# EAGLE design utrak (EAGLE 6.4)
uTrak Balloon Tracker Version 1.0
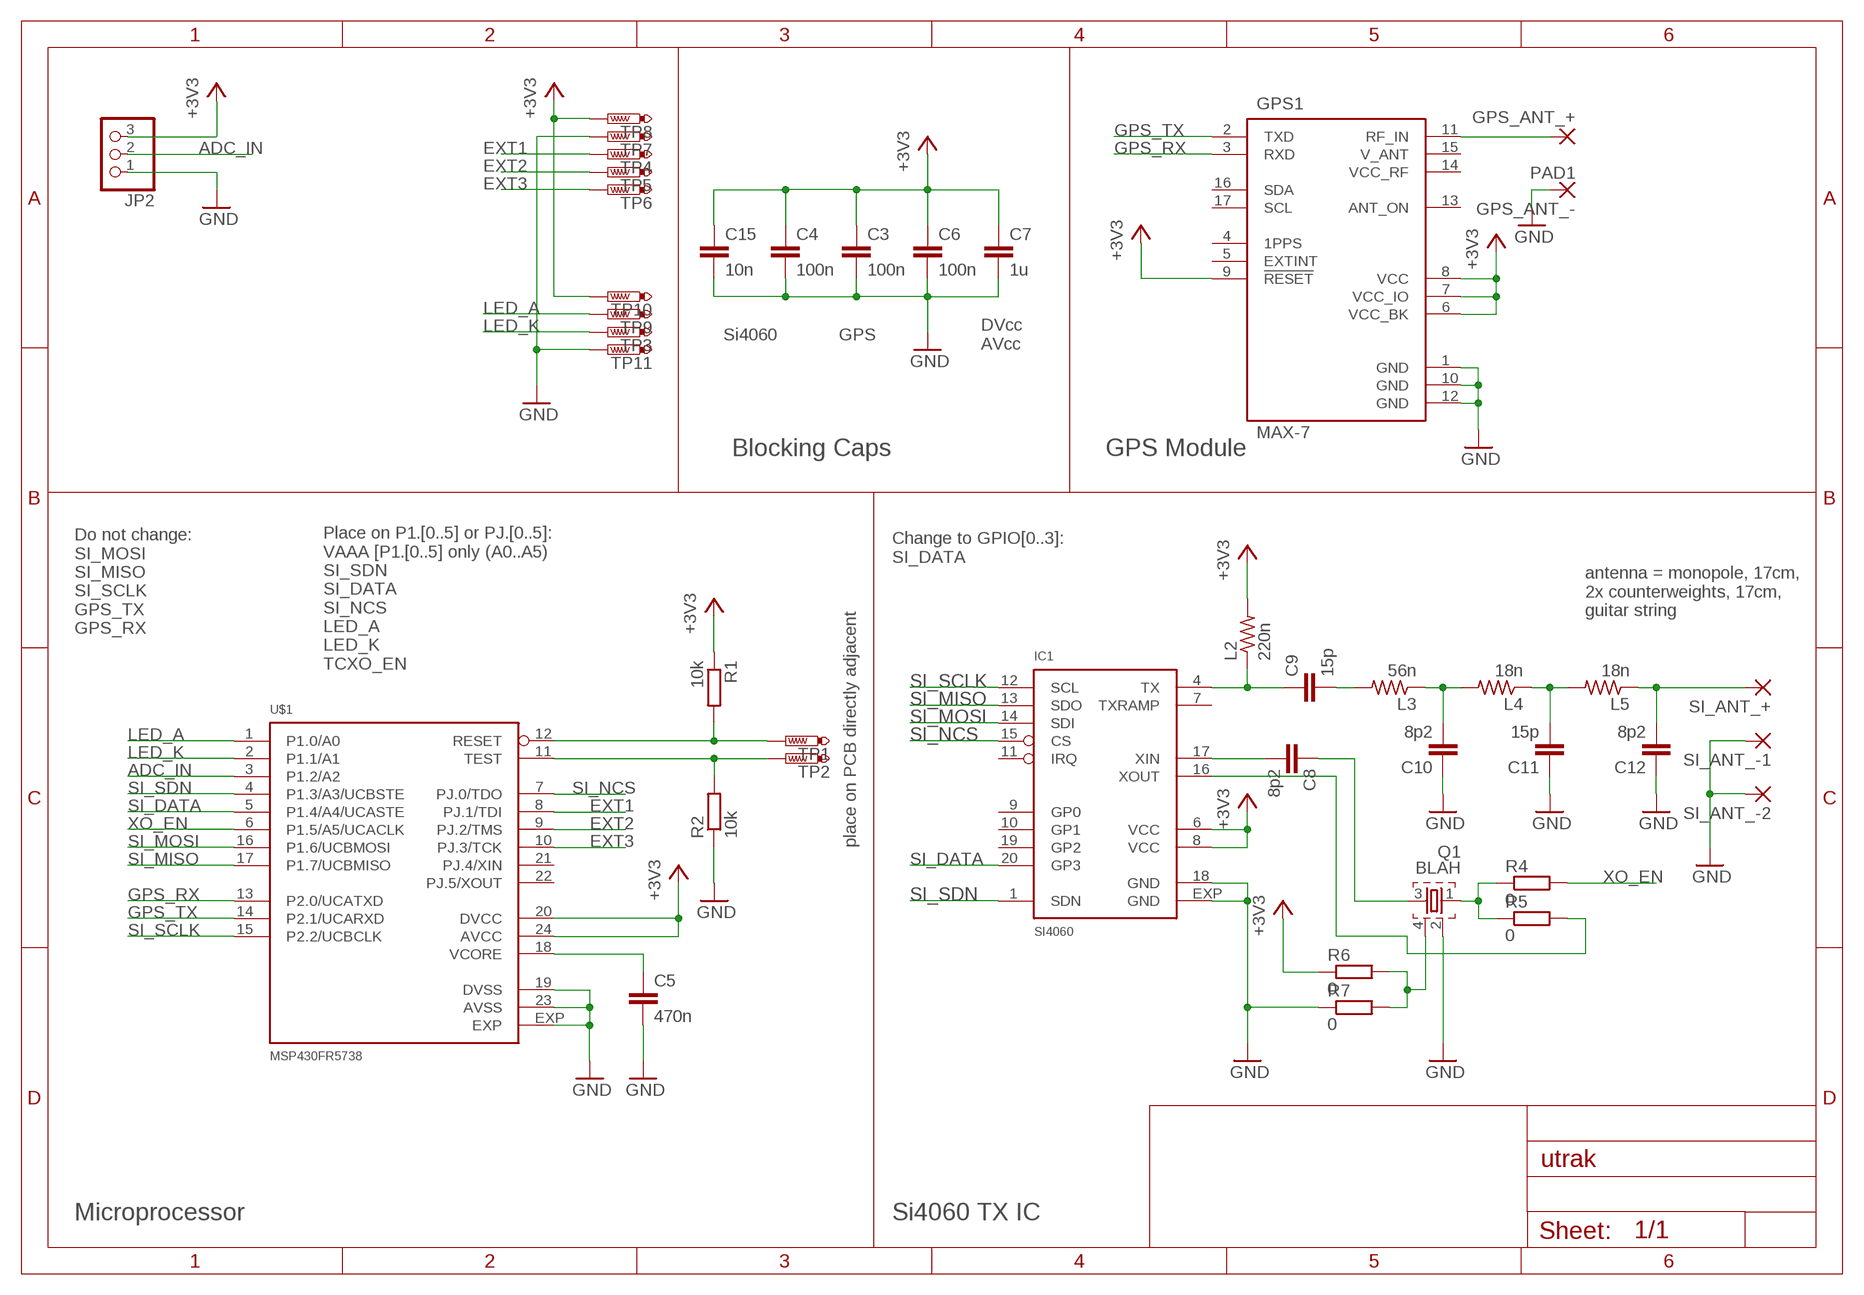
[diagram p0: schematic, sheet 1]

## Parts
C3  100n  C-EUC0603  [C0603]
C4  100n  C-EUC0603  [C0603]
C5  470n  C-EUC0805  [C0805]
C6  100n  C-EUC0603  [C0603]
C7  1u  C-EUC0603  [C0603]
C8  8p2  C-EUC0402  [C0402]
C9  15p  C-EUC0603  [C0603]
C10  8p2  C-EUC0603  [C0603]
C11  15p  C-EUC0603K  [C0603K]
C12  8p2  C-EUC0603  [C0603]
C15  10n  C-EUC0603  [C0603]
GPS1  MAX-7  [UBLOX-7]
GPS_ANT_+  SMD2  [SMD1,27-2,54]
GPS_ANT_-  PAD1  [SMD1,27-2,0]
IC1  SI4060  [QFN20]
JP2  PINHD-1X3  [1X03]
L2  220n  R-US_R0603  [R0603]
L3  56n  R-US_R0603  [R0603]
L4  18n  R-US_R0603  [R0603]
L5  18n  R-US_R0603  [R0603]
Q1  BLAH  [CTS406]
R1  10k  R-EU_R0402  [R0402]
R2  10k  R-EU_R0402  [R0402]
R4  0  R-EU_R0402  [R0402]
R5  0  R-EU_R0402  [R0402]
R6  0  R-EU_R0402  [R0402]
R7  0  R-EU_R0402  [R0402]
SI_ANT_+  SMD2  [SMD1,27-2,54]
SI_ANT_-1  SMD2  [SMD1,27-2,54]
SI_ANT_-2  SMD2  [SMD1,27-2,54]
TP1  PTR1TP07R  [TP07R]
TP2  PTR1TP07R  [TP07R]
TP3  PTR1TP07R  [TP07R]
TP4  PTR1TP07R  [TP07R]
TP5  PTR1TP07R  [TP07R]
TP6  PTR1TP07R  [TP07R]
TP7  PTR1TP07R  [TP07R]
TP8  PTR1TP07R  [TP07R]
TP9  PTR1TP07R  [TP07R]
TP10  PTR1TP07R  [TP07R]
TP11  PTR1TP07R  [TP07R]
U$1  MSP430FR5738  [QFN24-4X4]

## Nets
+3V3: C3.1 C4.1 C6.1 C7.1 C15.1 GPS1.6(VCC_BK) GPS1.7(VCC_IO) GPS1.8(VCC) GPS1.9(!RESET) IC1.6(VCC) IC1.8(VCC) JP2.3 L2.2 R1.1 R6.1 TP8.TP TP10.TP U$1.20(DVCC) U$1.24(AVCC)
ADC_IN: JP2.2 U$1.3(P1.2/A2)
EXT1: TP4.TP U$1.8(PJ.1/TDI)
EXT2: TP5.TP U$1.9(PJ.2/TMS)
EXT3: TP6.TP U$1.10(PJ.3/TCK)
GND: C3.2 C4.2 C5.2 C6.2 C7.2 C10.1 C11.1 C12.1 C15.2 GPS1.1(GND) GPS1.10(GND) GPS1.12(GND) GPS_ANT_-.P$1(P) IC1.18(GND) IC1.EXP(GND) JP2.1 Q1.2 R2.1 R7.1 SI_ANT_-1.1(P) SI_ANT_-2.1(P) TP7.TP TP11.TP U$1.19(DVSS) U$1.23(AVSS) U$1.EXP
GPS_ANT_+: GPS1.11(RF_IN) GPS_ANT_+.1(P)
GPS_RX: GPS1.3(RXD) U$1.13(P2.0/UCATXD)
GPS_TX: GPS1.2(TXD) U$1.14(P2.1/UCARXD)
LED_A: TP9.TP U$1.1(P1.0/A0)
LED_K: TP3.TP U$1.2(P1.1/A1)
N$2: C5.1 U$1.18(VCORE)
N$3: R2.2 TP2.TP U$1.11(TEST)
N$4: R1.2 TP1.TP U$1.12(RESET)
N$5: C9.1 IC1.4(TX) L2.1
N$6: C9.2 L3.2
N$7: C10.2 L3.1 L4.2
N$8: Q1.1 R4.1 R5.1
N$9: C11.2 L4.1 L5.2
N$10: C12.2 L5.1 SI_ANT_+.1(P)
N$11: Q1.4 R6.2 R7.2
N$12: C8.1 Q1.3
N$13: IC1.16(XOUT) R5.2
N$14: C8.2 IC1.17(XIN)
SI_DATA: IC1.20(GP3) U$1.5(P1.4/A4/UCASTE)
SI_MISO: IC1.13(SDO) U$1.17(P1.7/UCBMISO)
SI_MOSI: IC1.14(SDI) U$1.16(P1.6/UCBMOSI)
SI_NCS: IC1.15(CS) U$1.7(PJ.0/TDO)
SI_SCLK: IC1.12(SCL) U$1.15(P2.2/UCBCLK)
SI_SDN: IC1.1(SDN) U$1.4(P1.3/A3/UCBSTE)
XO_EN: R4.2 U$1.6(P1.5/A5/UCACLK)
Unconnected: GPS1.4(1PPS) GPS1.5(EXTINT) GPS1.13(ANT_ON) GPS1.14(VCC_RF) GPS1.15(V_ANT) GPS1.16(SDA) GPS1.17(SCL) IC1.7(TXRAMP) IC1.9(GP0) IC1.10(GP1) IC1.11(IRQ) IC1.19(GP2) U$1.21(PJ.4/XIN) U$1.22(PJ.5/XOUT)

## Notes on the sheet
- Si4060 | GPS
- DVcc
  AVcc
- Blocking Caps | GPS Module
- Change to GPIO[0..3]:
  SI_DATA
- antenna = monopole, 17cm, 
  2x counterweights, 17cm,
  guitar string
- Do not change:
  SI_MOSI
  SI_MISO
  SI_SCLK
  GPS_TX
  GPS_RX
- Place on P1.[0..5] or PJ.[0..5]:
  VAAA [P1.[0..5] only (A0..A5)
  SI_SDN
  SI_DATA
  SI_NCS
  LED_A
  LED_K
  TCXO_EN
- place on PCB directly adjacent
- Microprocessor | Si4060 TX IC

## Library data of the parts
C3-C12 C15 = rcl:C-EU: CAPACITOR, European symbol
GPS1 = ublox-gps:MAX-7
GPS_ANT_+ SI_ANT_+ SI_ANT_-1 SI_ANT_-2 = wirepad:SMD2: SMD PAD
GPS_ANT_- = wirepad:PAD1
IC1 = silabs-si6040:SI4060: SI4060 High-Performance, Low-Current Transmitter
JP2 = pinhead:PINHD-1X3: PIN HEADER
L2-L5 = rcl:R-US_: RESISTOR, American symbol
Q1 = crystal:BLAH
R1 R2 R4-R7 = rcl:R-EU_: RESISTOR, European symbol
TP1-TP11 = testpad:PTR1: TEST PIN
U$1 = msp430-fr:MSP430FR5738: MSP430FR5738 16bit Mixed Signal Microcontroller

## Board
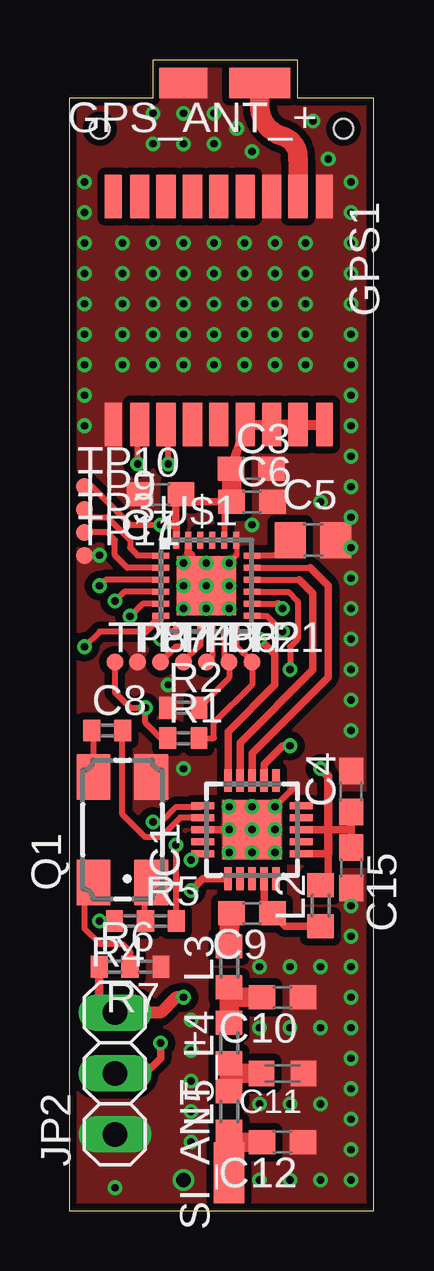
[diagram p1: board, top side]
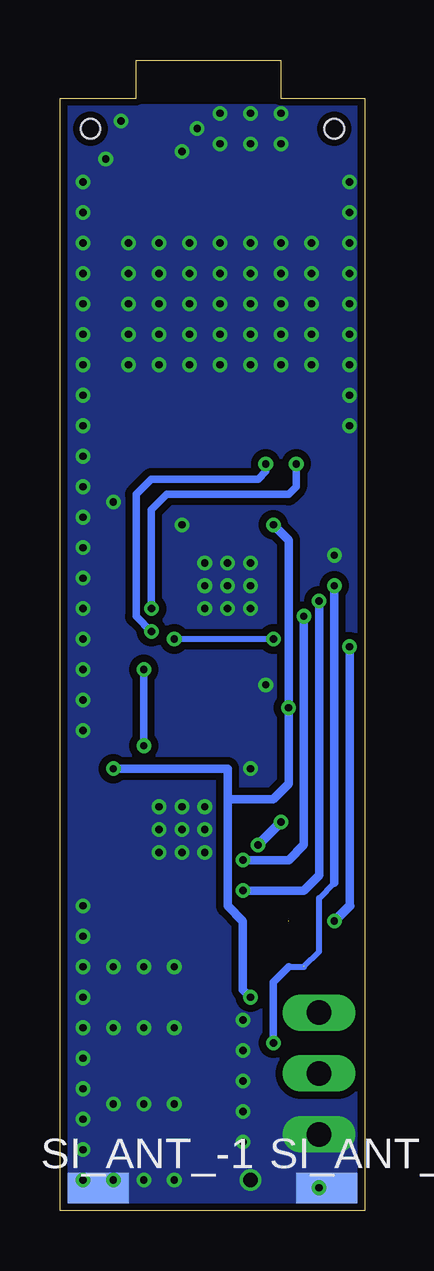
[diagram p2: board, bottom side, seen from below]

Size 12.7 x 47.94 mm. Coordinates in mm from the lower left corner, seen from the top.
Outline: 0,0 12.7,0 12.7,46.35 9.53,46.35 9.53,47.94 3.49,47.94 3.49,46.35 0,46.35 0,0
Copper layers (1*16): Top 0.035mm / dielectric 1.5mm / Bottom 0.035mm
Design rules "hackvana": minimum track width 6mil, minimum drill 0.3mm, track to track 6mil, track to pad 6mil, pad to pad 6mil, via to via 6mil, smd to smd 0mil, copper to edge 6mil, drill to drill 6mil, minimum pad ring 10mil, minimum via ring 6mil, stop-mask expansion 2mil, vias tented up to drill 100mil, thermal gap 10mil
Holes 0.81 mm at 1.27,45.09 11.43,45.09

### Footprints (pad centres in the part's own frame; a part is rotated, then mirrored left to right if it is on the bottom)
C0603 = smd 1.1 x 1: 1 -0.85,0; 2 0.85,0
C0805 = smd 1.3 x 1.5: 1 -0.95,0; 2 0.95,0
C0402 = smd 0.7 x 0.9: 1 -0.65,0; 2 0.65,0
C0603K = smd 1.05 x 1.08: 1 -0.875,0; 2 0.875,0
UBLOX-7 = smd 1.8 x 0.7: 1 4.838,-4.112; 9 4.838,4.688; 10 -4.662,4.688; 18 -4.662,-4.112 | smd 1.8 x 0.8: 2 4.838,-3.013; 3 4.838,-1.913; 4 4.838,-0.812; 5 4.838,0.287; 6 4.838,1.387; 7 4.838,2.487; 8 4.838,3.587; 11 -4.662,3.587; 12 -4.662,2.487; 13 -4.662,1.387; 14 -4.662,0.287; 15 -4.662,-0.812; 16 -4.662,-1.913; 17 -4.662,-3.013
SMD1,27-2,54 = smd 1.27 x 2.54: 1 0,0
SMD1,27-2,0 = smd 1.27 x 2: P$1 0,0
QFN20 = smd 0.95 x 0.3: 1 -2.05,1; 2 -2.05,0.5; 3 -2.05,0; 4 -2.05,-0.5; 5 -2.05,-1; 11 2.05,-1; 12 2.05,-0.5; 13 2.05,0; 14 2.05,0.5; 15 2.05,1 | smd 0.3 x 0.95: 6 -1,-2.05; 7 -0.5,-2.05; 8 0,-2.05; 9 0.5,-2.05; 10 1,-2.05; 16 1,2.05; 17 0.5,2.05; 18 0,2.05; 19 -0.5,2.05; 20 -1,2.05 | smd 2.45 x 2.45: EXP 0,0
1X03 = drill 1.016 long: 1 -2.54,0; 2 0,0; 3 2.54,0
R0603 = smd 1 x 1.1: 1 -0.85,0; 2 0.85,0
CTS406 = smd 1.9 x 1.4: 1 -2.2,-1.2; 2 2.2,-1.2; 3 2.2,1.2; 4 -2.2,1.2
R0402 = smd 0.7 x 0.9: 1 -0.65,0; 2 0.65,0
TP07R = smd 0.7 x 0.7: TP 0,0
QFN24-4X4 = smd 0.7 x 0.25: 1 -1.9,1.25; 2 -1.9,0.75; 3 -1.9,0.25; 4 -1.9,-0.25; 5 -1.9,-0.75; 6 -1.9,-1.25; 13 1.9,-1.25; 14 1.9,-0.75; 15 1.9,-0.25; 16 1.9,0.25; 17 1.9,0.75; 18 1.9,1.25 | smd 0.25 x 0.7: 7 -1.25,-1.9; 8 -0.75,-1.9; 9 -0.25,-1.9; 10 0.25,-1.9; 11 0.75,-1.9; 12 1.25,-1.9; 19 1.25,1.9; 20 0.75,1.9; 21 0.25,1.9; 22 -0.25,1.9; 23 -0.75,1.9; 24 -1.25,1.9 | smd 2.45 x 2.45: EXP 0,0

### Placement (x,y rotation side)
C3  7.59,30.91 0 top
C4  11.75,17.46 90 top
C5  10.16,27.94 0 top
C6  7.62,29.53 0 top
C7  3.81,29.84 180 top
C8  1.59,20 0 top
C9  7.62,12.38 180 top
C10  8.89,8.89 180 top
C11  8.89,5.71 180 top
C12  8.89,2.86 180 top
C15  11.75,14.29 270 top
GPS1  5.95,37.59 270 top
GPS_ANT_+  7.94,46.99 90 top
GPS_ANT_-  4.76,46.99 90 top
IC1  7.62,15.88 90 top
JP2  1.91,5.71 90 top
L2  10.48,12.7 90 top
L3  6.67,10.16 90 top
L4  6.67,6.99 90 top
L5  6.67,4.13 90 top
Q1  2.22,15.88 90 top
R1  4.76,19.68 0 top
R2  4.76,20.95 0 top
R4  2.54,12.06 180 top
R5  3.81,12.06 0 top
R6  1.91,10.16 0 top
R7  3.17,10.16 180 top
SI_ANT_+  6.67,1.59 0 top
SI_ANT_-1  11.11,0.95 270 bottom
SI_ANT_-2  1.59,0.95 270 bottom
TP1  7.62,22.86 0 top
TP2  6.67,22.86 0 top
TP3  0.64,28.26 0 top
TP4  3.81,22.86 0 top
TP5  4.76,22.86 0 top
TP6  5.71,22.86 0 top
TP7  2.86,22.86 0 top
TP8  1.91,22.86 0 top
TP9  0.64,29.21 0 top
TP10  0.64,30.16 0 top
TP11  0.64,27.3 0 top
U$1  5.71,26.04 0 top

### Tracks (layer width: path | path; a pad name or v marks a point on that pad's centre or on a via)
+3V3  (via drill 0.3)
  Top 0.254: C6.1 6.46,29.53 U$1.20 | TP8.TP 1.91,21.59 2.54,20.95 v3.17,20.95 3.17,20.32 3.81,19.68 R1.1 | C7.1 4.66,29.74 4.45,29.53 | TP10.TP 0.95,30.16 2.54,28.57 v3.81,28.57
  Top 0.305: U$1.24 4.46,28.55 4.45,28.57 4.45,29.53 C6.1 | IC1.8 10.79,15.88 11.75,15.88 | IC1.6 10.79,14.88 10.79,13.55 L2.2 | 11.75,15.88 C15.1 | 11.75,15.88 C4.1
  Top 0.356: v10.48,18.41 10.79,18.1 10.79,15.88 10.79,14.88 | v3.81,28.57 4.45,28.57 | R6.1 1.25,8.9 JP2.3 | C3.1 7.37,32.72 GPS1.6
  Top 0.406: GPS1.6 GPS1.7 GPS1.8 GPS1.9
  Top 0.508: JP2.3 3.81,8.26 4.45,8.89 v4.76,8.89
  Top 0.813: C3.1 6.77,30.91 C6.1
  Bottom 0.356: v10.48,18.41 5.71,18.41 5.71,17.14 | 5.71,17.14 5.71,12.7 5.08,12.06 5.08,9.21 v4.76,8.89 | v3.81,28.57 3.17,27.94 v3.17,20.95 3.17,17.78 3.81,17.14 5.71,17.14
ADC_IN  (via drill 0.3)
  Top 0.254: U$1.3 1.52,26.29 v1.27,26.04
  Top 0.305: v3.81,6.99 3.81,6.35 3.17,5.71 JP2.2
  Bottom 0.254: 3.17,10.16 2.54,10.16 1.91,10.79 1.91,13.02 1.27,13.65
  Bottom 0.305: 3.17,10.16 3.81,9.53 v3.81,6.99
  Bottom 0.356: 1.27,13.65 v1.27,26.04
EXT1
  Top 0.254: U$1.8 4.96,23.7 4.76,23.5 4.45,23.5 TP4.TP
EXT2
  Top 0.254: TP5.TP 5.46,23.56 U$1.9
EXT3
  Top 0.254: U$1.10 5.96,23.11 TP6.TP
GND  (via drill 0.3, 0.6)
  Top 0.203: 6.99,27.94 6.99,27.3 v6.67,26.99
  Top 0.254: IC1.EXP 9.53,17.78
  Top 0.305: U$1.23 4.96,27.42 | IC1.18 v6.67,15.88
  Top 0.356: 4.96,27.42 5.08,27.3 5.08,26.67
  other vias: 1.91,0.95 4.76,26.99 5.71,26.99 4.76,26.04 4.76,25.08 5.71,25.08 5.71,26.04 6.67,16.83 6.67,14.92 7.62,14.92 8.57,14.92 8.57,15.88 7.62,15.88 7.62,16.83 8.57,16.83 4.13,21.91 6.67,26.04 6.67,25.08 9.21,4.45 10.48,4.45 7.94,7.62 9.21,7.62 11.75,10.16 11.75,3.81 11.75,5.08 11.75,7.62 11.75,11.43 10.48,7.62 7.94,4.45 10.48,29.53 11.75,30.16 11.75,26.35 11.75,25.08 11.75,23.81 11.75,22.54 11.75,21.27 7.62,28.57 7.94,1.27 9.21,1.27 10.48,1.27 11.75,1.27 11.75,2.54 2.22,40.32 3.49,40.32 4.76,40.32 6.03,40.32 7.3,40.32 8.57,40.32 9.84,40.32 2.22,39.05 2.22,37.78 2.22,36.51 2.22,35.24 3.49,35.24 4.76,35.24 6.03,35.24 7.3,35.24 8.57,35.24 9.84,35.24 9.84,36.51 9.84,37.78 9.84,39.05 8.57,39.05 7.3,39.05 6.03,39.05 4.76,39.05 3.49,39.05 3.49,37.78 3.49,36.51 4.76,36.51 6.03,37.78 4.76,37.78 6.03,36.51 7.3,36.51 7.3,37.78 8.57,37.78 8.57,36.51 7.62,44.13 6.99,45.09 10.16,45.4 10.79,43.81 11.75,42.86 11.75,41.59 11.75,40.32 11.75,39.05 11.75,37.78 11.75,36.51 11.75,35.24 11.75,33.97 11.75,32.7 11.75,31.43 0.64,32.7 0.64,33.97 0.64,35.24 0.64,36.51 0.64,37.78 0.64,39.05 0.64,40.32 0.64,41.59 0.64,42.86 5.08,2.86 5.08,4.13 5.08,5.4 5.08,6.67 5.08,7.94 4.76,18.41 4.76,1.27 7.94,10.16 9.21,10.16 10.48,10.16 11.75,8.89 11.75,28.89 11.75,27.62 11.75,20 11.75,12.7 11.75,6.35 3.49,44.45 4.76,44.45 6.03,44.45 6.03,45.72 4.76,45.72 3.49,45.72 1.27,27.3
  pour Top (isolate 0.305, no thermals): 0,0 12.7,0 12.7,47.94 0,47.94
  pour Bottom (isolate 0.305, no thermals): 0,0 12.7,0 12.7,46.04 0,46.04
GPS_ANT_+
  Top 0.813: GPS_ANT_+.1 7.94,46.04 arc74 8.89,44.77 arc-80 9.53,43.81 9.54,43.81 GPS1.11
GPS_RX  (via drill 0.3)
  Top 0.254: 7.62,24.77 U$1.13 8.23,24.79 v8.89,24.13 | v4.13,31.11 4.13,32.66 GPS1.3
  Bottom 0.305: v8.89,24.13 9.53,24.77 9.53,29.84 8.89,30.48 4.45,30.48 4.13,30.8 v4.13,31.11
GPS_TX  (via drill 0.3)
  Top 0.254: U$1.14 8.69,25.29 | v2.86,31.11 2.86,32.67 GPS1.2
  Top 0.305: 8.69,25.29 v8.89,25.08
  Bottom 0.305: v8.89,25.08 8.89,29.21 8.26,29.84 3.17,29.84 2.86,30.16 v2.86,31.11
LED_A
  Top 0.254: TP9.TP 0.95,28.89 1.59,28.89 2.54,27.94 2.54,27.62 2.86,27.3 3.79,27.3 U$1.1
  Top 0.305: U$1.1
LED_K
  Top 0.254: U$1.2 2.42,26.79 1.91,27.3 1.91,27.94 1.59,28.26 TP3.TP
N$2
  Top 0.254: U$1.18 8.57,27.3 C5.1
N$3
  Top 0.254: U$1.11 6.46,23.06 TP2.TP 6.67,22.21 R2.2
N$4
  Top 0.254: U$1.12 6.96,23.52 TP1.TP 7.62,21.91 6.03,20.32 6.03,19.68 R1.2
N$5
  Top 0.305: IC1.4 8.12,12.2 C9.1 9,11.85 L2.1
N$6
  Top 0.813: L3.2 6.67,11.74 C9.2
N$7
  Top 0.813: L4.2 6.67,8.89 | 6.67,8.89 L3.1 | C10.2 6.67,8.89
N$8  (1 unrouted)
  Top 0.254: R5.1 3.16,13.41 Q1.1
N$9
  Top 0.813: L5.2 6.67,5.71 | 6.67,5.71 L4.1 | C11.2 6.67,5.71
N$10
  Top 0.813: SI_ANT_+.1 6.67,2.86 | 6.67,2.86 L5.1 | C12.2 6.67,2.86
N$11  (1 unrouted)
  Top 0.254: R7.2 2.54,10.18 2.54,10.79 2.22,11.11 1.27,11.11 0.64,11.75 0.64,13.34 0.97,13.68 Q1.4
N$12
  Top 0.254: Q1.3 1.02,19.92 C8.1
N$13  (via drill 0.3)
  Top 0.254: v4.45,15.24 4.45,12.08 R5.2 | v3.49,16.19 3.81,16.19 4.45,16.83 5.52,16.83 IC1.16
  Bottom 0.406: v3.49,16.19 v4.45,15.24
N$14
  Top 0.254: C8.2 2.22,19.99 2.22,16.51 3.17,15.56 3.81,15.56 4.63,16.38 IC1.17
SI_DATA  (via drill 0.3)
  Top 0.254: U$1.5 3.06,25.29 v2.54,24.77
  Top 0.305: IC1.20 5.35,14.88 v5.08,14.61
  Bottom 0.356: v2.54,24.77 2.54,15.24 3.17,14.61 v5.08,14.61
SI_MISO
  Top 0.254: U$1.17 10.04,26.79
  Top 0.305: 10.04,26.79 10.79,26.04 10.79,22.23 7.62,19.05 IC1.13
SI_MOSI
  Top 0.254: U$1.16 9.59,26.29
  Top 0.305: 9.59,26.29 10.16,25.72 10.16,22.54 7.12,19.5 IC1.14
SI_NCS  (via drill 0.3)
  Top 0.254: U$1.7 4.13,24.14 3.81,24.13 v3.81,23.81
  Top 0.305: IC1.15 6.62,19.95 8.57,21.91 8.57,23.18 v7.94,23.81
  Bottom 0.254: v3.81,23.81 v7.94,23.81
SI_SCLK  (via drill 0.3)
  Top 0.254: U$1.15 9.14,25.79 9.53,25.4 9.53,23.81 9.21,23.5 v9.21,22.54
  Top 0.305: IC1.12 8.12,18.6 8.89,19.37 v9.21,19.37
  Bottom 0.305: v9.21,19.37 v9.21,22.54
SI_SDN  (via drill 0.3)
  Top 0.254: U$1.4 2.29,25.79 v1.91,25.4
  Top 0.305: IC1.1 5.57,13.82 v5.08,13.34
  Bottom 0.356: v1.91,25.4 1.91,13.97 2.54,13.34 v5.08,13.34
XO_EN  (via drill 0.3)
  Top 0.254: R4.2 v1.27,12.06 | 3.17,24.13 1.27,24.13 v0.64,23.5
  Top 0.305: U$1.6 3.81,24.77 3.17,24.13
  Bottom 0.356: v0.64,23.5 0.64,12.7
  Bottom 0.406: v1.27,12.06 0.64,12.7

### Text on the board
bStefan: uTrak GPS Tracker v1.0 / High altitude balloon payload / / If found, please call: / Stefan Biereigel, DK3SB / +49 171 / 159 4497